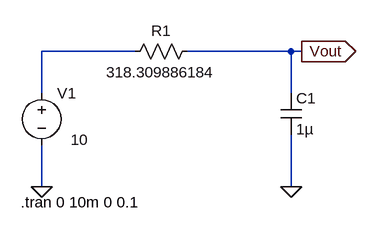
[diagram p0: schematic Draft2.asc]
Draft2.asc, the LTspice schematic file:
Version 4
SHEET 1 880 680
WIRE 160 112 16 112
WIRE 400 112 240 112
WIRE 416 112 400 112
WIRE 16 176 16 112
WIRE 400 176 400 112
WIRE 16 320 16 256
WIRE 400 320 400 240
FLAG 16 320 0
FLAG 400 320 0
FLAG 416 112 Vout
IOPIN 416 112 Out
SYMBOL res 256 96 R90
WINDOW 0 0 56 VBottom 2
WINDOW 3 32 56 VTop 2
SYMATTR InstName R1
SYMATTR Value 318.309886184
SYMBOL cap 384 176 R0
SYMATTR InstName C1
SYMATTR Value 1µ
SYMBOL voltage 16 160 R0
WINDOW 3 45 88 Left 2
WINDOW 123 45 60 Left 2
WINDOW 39 0 0 Left 0
SYMATTR Value 10
SYMATTR InstName V1
TEXT -16 344 Left 2 !.tran 0 10m 0 0.1

The netlist it stands for:
* Draft2.asc
R1 Vout N001 318.309886184
C1 Vout 0 1µ
V1 N001 0 10
.tran 0 10m 0 0.1
.backanno
.end